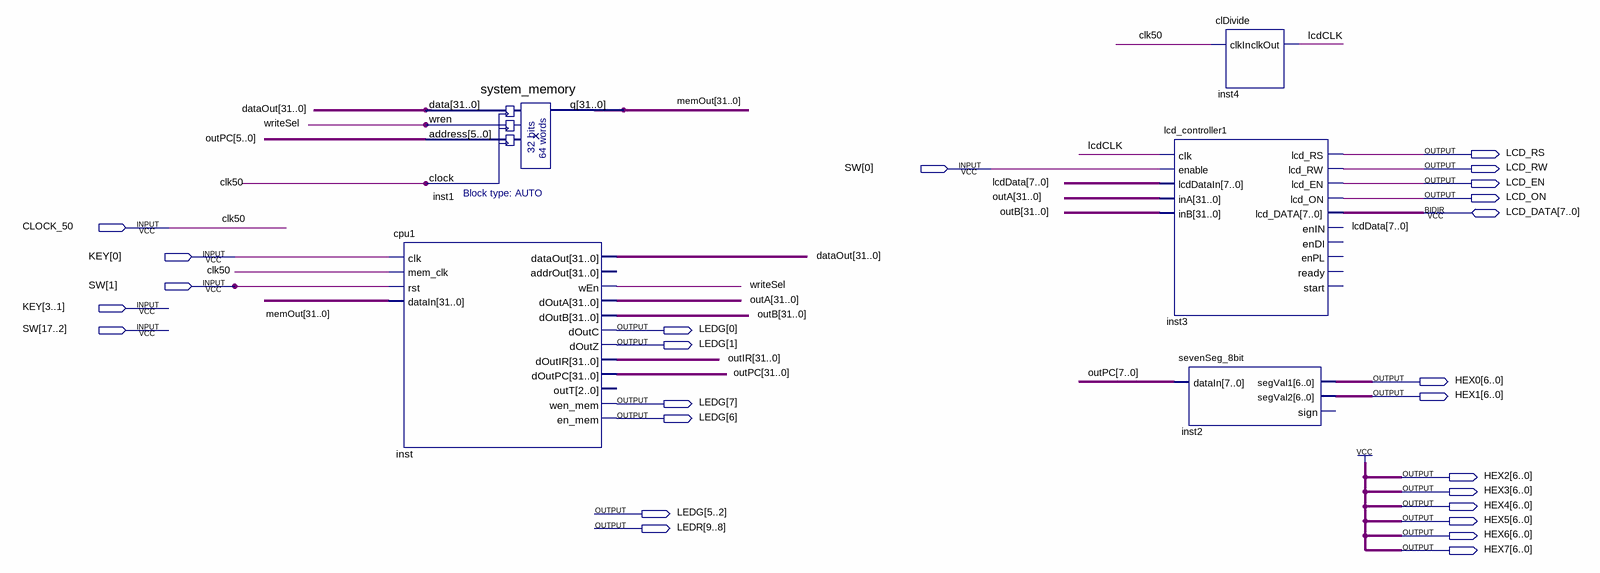
[diagram p0: schematic sheet]
// Quartus schematic CPU_TEST_Sim.bdf as structural Verilog: 5 symbols, 25 pins
module CPU_TEST_Sim (
  input  [17:0] SW,
  input  CLOCK_50,
  input  [3:0] KEY,
  inout  [7:0] LCD_DATA,
  output LCD_RS,
  output LCD_RW,
  output LCD_EN,
  output LCD_ON,
  output [7:0] LEDG,
  output [6:0] HEX0,
  output [6:0] HEX1,
  output [6:0] HEX2,
  output [6:0] HEX3,
  output [6:0] HEX4,
  output [6:0] HEX5,
  output [9:8] LEDR,
  output [6:0] HEX6,
  output [6:0] HEX7
);

  wire lcdCLK, writeSel;
  wire [31:0] dataOut, memOut, outA, outB, outIR, outPC;

  cpu1 inst (
    .clk(KEY[0]), .mem_clk(CLOCK_50), .rst(SW[1]), .dataIn(memOut), .dataOut(dataOut), .wEn(writeSel),
    .dOutA(outA), .dOutB(outB), .dOutC(LEDG[0]), .dOutZ(LEDG[1]), .dOutIR(outIR), .dOutPC(outPC),
    .wen_mem(LEDG[7]), .en_mem(LEDG[6]));  // open: addrOut, outT
  system_memory inst1 (.data(dataOut), .wren(writeSel), .address(outPC[5:0]), .clock(CLOCK_50), .q(memOut));
  lcd_controller1 inst3 (
    .clk(lcdCLK), .enable(SW[0]), .lcdDataIn(LCD_DATA), .inA(outA), .inB(outB), .lcd_RS(LCD_RS),
    .lcd_RW(LCD_RW), .lcd_EN(LCD_EN), .lcd_ON(LCD_ON), .lcd_DATA(LCD_DATA));  // open: enIN, enDI, enPL, ready, start
  clDivide inst4 (.clkIn(CLOCK_50), .clkOut(lcdCLK));
  sevenSeg_8bit inst2 (.dataIn(outPC[7:0]), .segVal1(HEX0), .segVal2(HEX1));  // open: sign

  assign HEX2 = {7{1'b1}};
  assign HEX3 = {7{1'b1}};
  assign HEX4 = {7{1'b1}};
  assign HEX5 = {7{1'b1}};
  assign HEX6 = {7{1'b1}};
  assign HEX7 = {7{1'b1}};

  // Other names for the same wires on the sheet: clk50 = CLOCK_50; lcdData[7:0] = LCD_DATA
endmodule
